# EAGLE design Adafruit nRF52 Bluefruit Feather rev G (EAGLE 6.6.0)
COMPANY: ADAFRUIT INDUSTRIES; DRAWN: KTOWN; REV: G
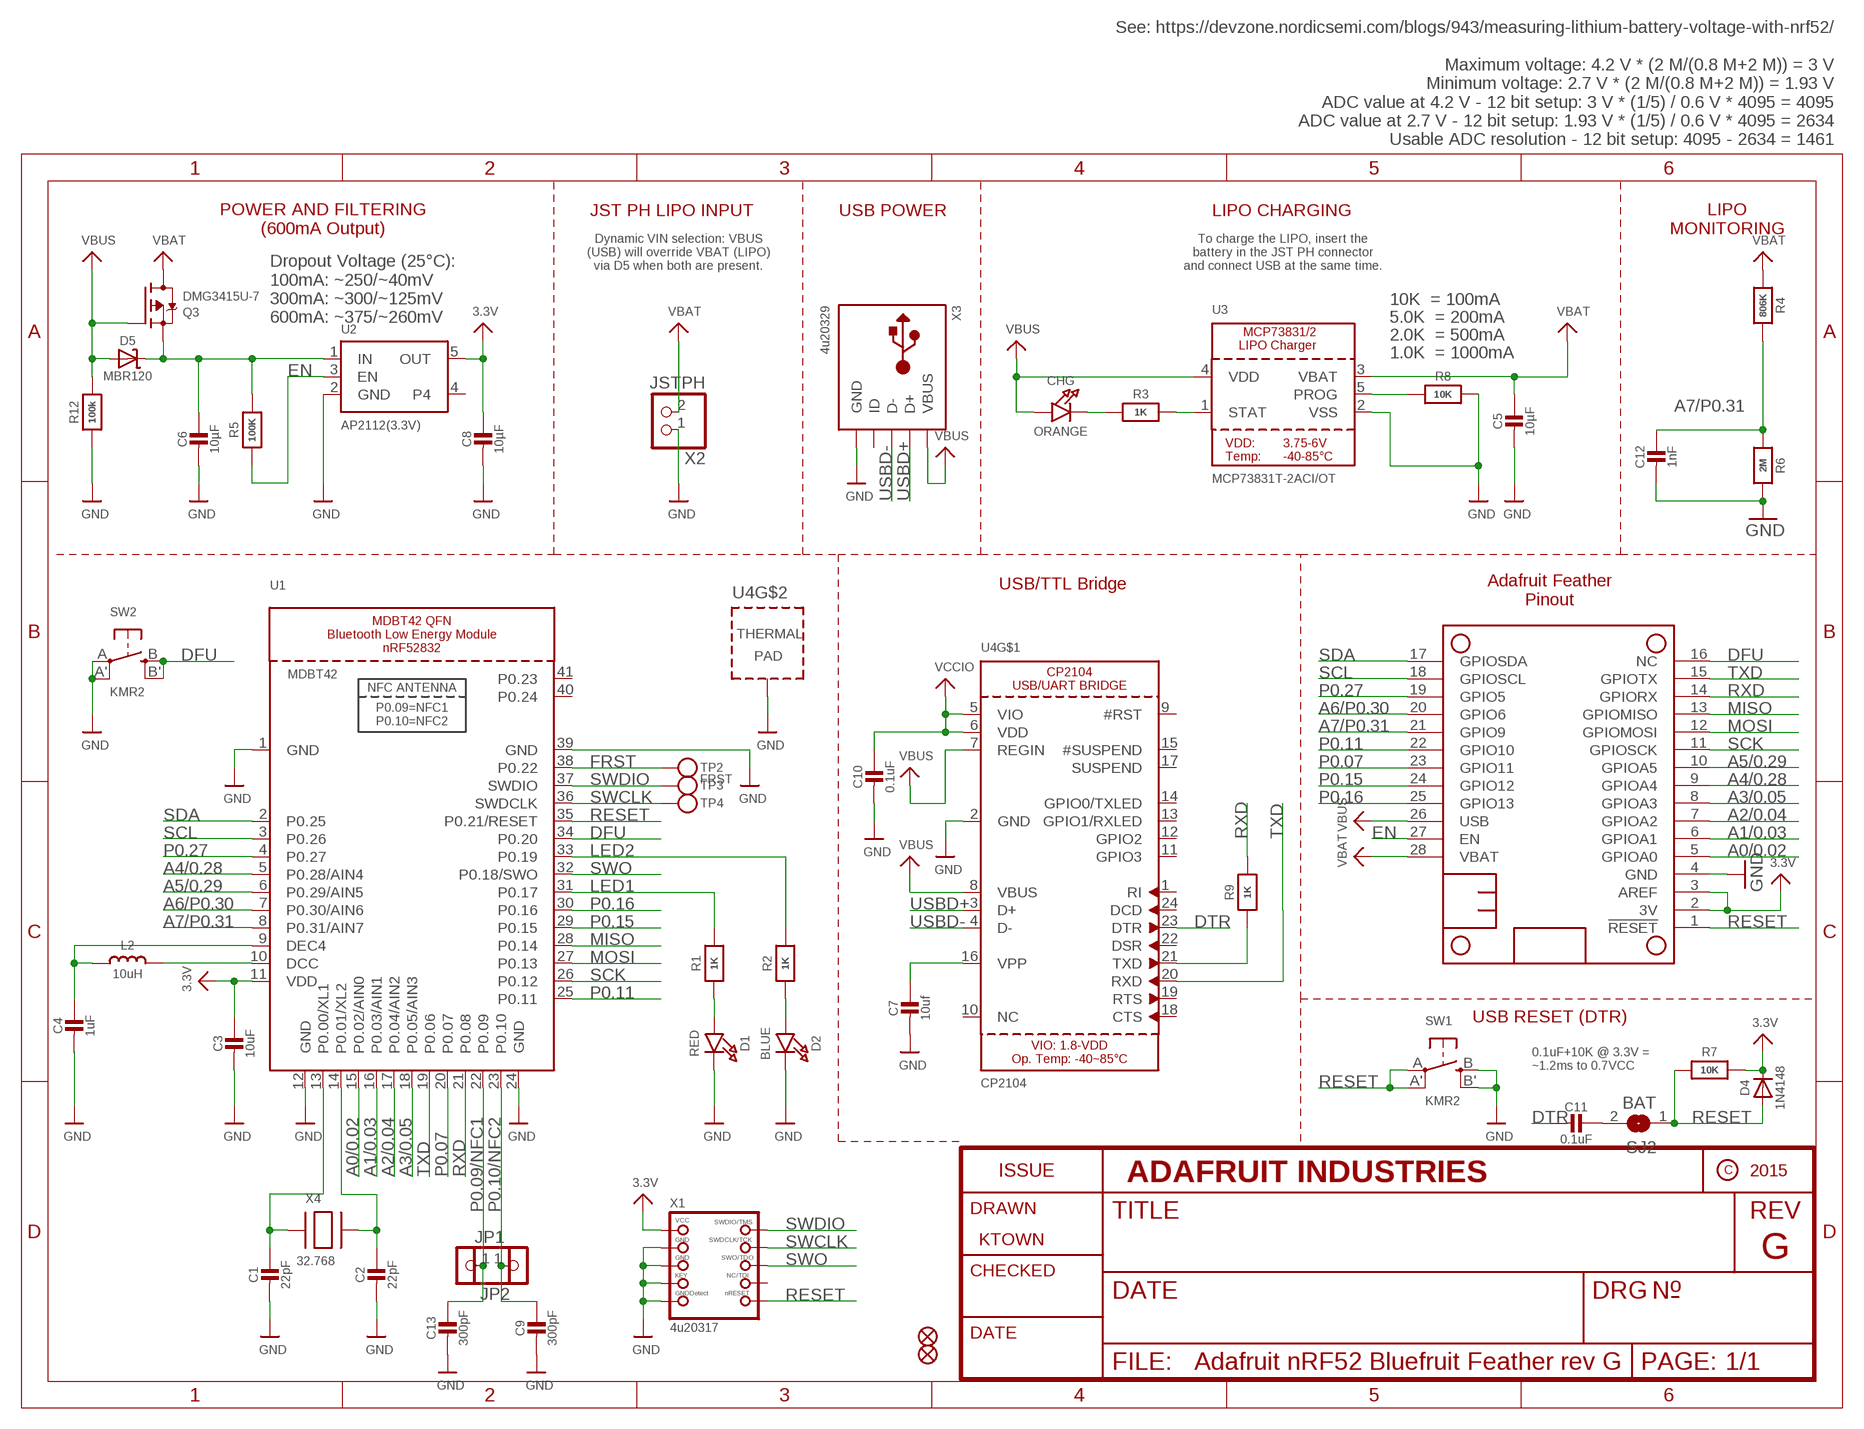
[diagram p0: schematic, sheet 1]

## Parts
C1  22pF  CAP_CERAMIC0603_NO  [0603-NO]
C2  22pF  CAP_CERAMIC0603_NO  [0603-NO]
C3  10uF  CAP_CERAMIC0805-NOOUTLINE  [0805-NO]
C4  1uF  CAP_CERAMIC0603_NO  [0603-NO]
C5  10µF  CAP_CERAMIC0805-NOOUTLINE  [0805-NO]
C6  10µF  CAP_CERAMIC0805-NOOUTLINE  [0805-NO]
C7  10uf  CAP_CERAMIC0805-NOOUTLINE  [0805-NO]
C8  10µF  CAP_CERAMIC0805-NOOUTLINE  [0805-NO]
C9  300pF  CAP_CERAMIC_0603MP  [_0603MP]
C10  0.1uF  CAP_CERAMIC0603_NO  [0603-NO]
C11  0.1uF  CAP_CERAMIC0603_NO  [0603-NO]
C12  1nF  CAP_CERAMIC0603_NO  [0603-NO]
C13  300pF  CAP_CERAMIC_0603MP  [_0603MP]
CHG  ORANGE  LED0805_NOOUTLINE  [CHIPLED_0805_NOOUTLINE]
D1  RED  LED0805_NOOUTLINE  [CHIPLED_0805_NOOUTLINE]
D2  BLUE  LED0805_NOOUTLINE  [CHIPLED_0805_NOOUTLINE]
D4  1N4148  DIODESOD-323  [SOD-323]
D5  MBR120  DIODE-SCHOTTKYSOD-123  [SOD-123]
FID1  FIDUCIAL_1MM  [FIDUCIAL_1MM]
FID3  FIDUCIAL_1MM  [FIDUCIAL_1MM]
JP1  HEADER-1X12MM  [1X01_2MM]
JP2  HEADER-1X12MM  [1X01_2MM]
L2  10uH  INDUCTOR0805-NO  [0805-NO]
MS1  FEATHERWING_NODIM  [FEATHERWING_NODIM]
Q3  DMG3415U-7  MOSFET-P  [SOT23-R]
R1  1K  RESISTOR_0603_NOOUT  [0603-NO]
R2  1K  RESISTOR_0603_NOOUT  [0603-NO]
R3  1K  RESISTOR_0603_NOOUT  [0603-NO]
R4  806K  RESISTOR_0603_NOOUT  [0603-NO]
R5  100K  RESISTOR_0603_NOOUT  [0603-NO]
R6  2M  RESISTOR_0603_NOOUT  [0603-NO]
R7  10K  RESISTOR_0603_NOOUT  [0603-NO]
R8  10K  RESISTOR_0603_NOOUT  [0603-NO]
R9  1K  RESISTOR_0603_NOOUT  [0603-NO]
R12  100k  RESISTOR_0603_NOOUT  [0603-NO]
SJ2  BAT  SOLDERJUMPERCLOSED  [SOLDERJUMPER_CLOSEDWIRE]
SW1  KMR2  SWITCH_TACT_SMT4.6X2.8  [BTN_KMR2_4.6X2.8]
SW2  KMR2  SWITCH_TACT_SMT4.6X2.8  [BTN_KMR2_4.6X2.8]
TP2  FRST  TESTPOINT1.5X2.0MM_NOCREAM  [PAD-1.5X2.0]
TP3  TESTPOINTROUND2MM  [TESTPOINT_ROUND_2MM]
TP4  TESTPOINTROUND2MM  [TESTPOINT_ROUND_2MM]
U1  MDBT42  NRF52832_MODULE_MDBT42  [BLE_MODULE_RAYTAC_MDBT42]
U2  AP2112(3.3V)  VREG_SOT23-5  [SOT23-5]
U3  MCP73831T-2ACI/OT  MCP73831/2  [SOT23-5]
U4  CP2104  [QFN24_4MM_SMSC]
X1  4u20317  JTAG-CORTEXBOXPOSTS  [2X05_1.27MM_BOX_POSTS]
X2  JSTPH  CON_JST_PH_2PIN  [JSTPH2]
X3  4u20329  USB_MICRO_20329_V2  [4UCONN_20329_V2]
X4  32.768  XTAL-3.2X1.5  [XTAL3215]

## Nets
3.3V: C3.1 C8.1 D4.C MS1.2(3V) MS1.3(AREF) R7.2 U1.11(VDD) U2.5(OUT) X1.1(VCC)
A0/0.02: MS1.5(GPIOA0) U1.15(P0.02/AIN0)
A1/0.03: MS1.6(GPIOA1) U1.16(P0.03/AIN1)
A2/0.04: MS1.7(GPIOA2) U1.17(P0.04/AIN2)
A3/0.05: MS1.8(GPIOA3) U1.18(P0.05/AIN3)
A4/0.28: MS1.9(GPIOA4) U1.5(P0.28/AIN4)
A5/0.29: MS1.10(GPIOA5) U1.6(P0.29/AIN5)
A6/P0.30: MS1.20(GPIO6) U1.7(P0.30/AIN6)
A7/P0.31: C12.1 MS1.21(GPIO9) R4.2 R6.1 U1.8(P0.31/AIN7)
DFU: MS1.16(NC) SW2.B'(S1) SW2.B(S) U1.34(P0.20)
DTR: C11.2 U4.23(DTR)
EN: MS1.27(EN) R5.1 U2.3(EN)
FRST: TP2.P$1 U1.38(P0.22)
GND: C1.2 C2.2 C3.2 C4.2 C5.2 C6.2 C7.2 C8.2 C9.2 C10.2 C12.2 C13.2 D1.C D2.C MS1.4(GND) R6.2 R8.2 R12.1 SW1.B'(S1) SW1.B(S) SW2.A'(P1) SW2.A(P) U1.1(GND) U1.12(GND) U1.24(GND) U1.39(GND) U2.2(GND) U3.2(VSS) U4.2(GND) U4.THERM(TP) X1.3(GND) X1.5(GND) X1.7(KEY) X1.9(GNDDETECT) X2.1 X3.BASE@1(GND) X3.BASE@2(GND) X3.GND X3.SPRT@1(GND) X3.SPRT@2(GND) X3.SPRT@3(GND) X3.SPRT@4(GND)
LED1: R1.2 U1.31(P0.17)
LED2: R2.2 U1.33(P0.19)
MISO: MS1.13(GPIOMISO) U1.28(P0.14)
MOSI: MS1.12(GPIOMOSI) U1.27(P0.13)
N$1: C1.1 U1.13(P0.00/XL1) X4.P$1
N$2: C2.1 U1.14(P0.01/XL2) X4.P$2
N$3: L2.2 U1.10(DCC)
N$4: CHG.C R3.1
N$5: D1.A R1.1
N$7: D2.A R2.1
N$8: C4.1 L2.1 U1.9(DEC4)
N$9: R3.2 U3.1(STAT)
N$10: R8.1 U3.5(PROG)
N$11: R9.1 U4.21(TXD)
N$13: C11.1 SJ2.2
N$14: C7.1 U4.16(VPP)
P0.07: MS1.23(GPIO11) U1.20(P0.07)
P0.09/NFC1: C13.1 JP2.1 U1.22(P0.09)
P0.10/NFC2: C9.1 JP1.1 U1.23(P0.10)
P0.11: MS1.22(GPIO10) U1.25(P0.11)
P0.15: MS1.24(GPIO12) U1.29(P0.15)
P0.16: MS1.25(GPIO13) U1.30(P0.16)
P0.27: MS1.19(GPIO5) U1.4(P0.27)
RESET: D4.A MS1.1(!RESET) R7.1 SJ2.1 SW1.A'(P1) SW1.A(P) U1.35(P0.21/RESET) X1.10(NRESET)
RXD: MS1.14(GPIORX) R9.2 U1.21(P0.08)
SCK: MS1.11(GPIOSCK) U1.26(P0.12)
SCL: MS1.18(GPIOSCL) U1.3(P0.26)
SDA: MS1.17(GPIOSDA) U1.2(P0.25)
SWCLK: TP4.P$1 U1.36(SWDCLK) X1.4(SWDCLK)
SWDIO: TP3.P$1 U1.37(SWDIO) X1.2(SWDIO)
SWO: U1.32(P0.18/SWO) X1.6(SWO)
TXD: MS1.15(GPIOTX) U1.19(P0.06) U4.20(RXD)
USBD+: U4.3(D+) X3.D+
USBD-: U4.4(D-) X3.D-
VBAT: C5.1 MS1.28(VBAT) Q3.3(D) R4.1 U3.3(VBAT) X2.2
VBUS: CHG.A D5.A MS1.26(USB) Q3.1(G) R12.2 U3.4(VDD) U4.7(REGIN) U4.8(VBUS) X3.VBUS
VCCIO: C10.1 U4.5(VIO) U4.6(VDD)
VIN: C6.1 D5.C Q3.2(S) R5.2 U2.1(IN)
Unconnected: U1.40(P0.24) U1.41(P0.23) U2.4 U4.1(RI) U4.9(#RST) U4.10(NC) U4.11(GPIO3) U4.12(GPIO2) U4.13(GPIO1/RXLED) U4.14(GPIO0/TXLED) U4.15(#SUSPEND) U4.17(SUSPEND) U4.18(CTS) U4.19(RTS) U4.22(DSR) U4.24(DCD) X1.8(TDI) X3.ID

## Notes on the sheet
- See: https://devzone.nordicsemi.com/blogs/943/measuring-lithium-battery-voltage-with-nrf52/
  
  Maximum voltage: 4.2 V * (2 M/(0.8 M+2 M)) = 3 V
  Minimum voltage: 2.7 V * (2 M/(0.8 M+2 M)) = 1.93 V
  ADC value at 4.2 V - 12 bit setup: 3 V * (1/5) / 0.6 V * 4095 = 4095
  ADC value at 2.7 V - 12 bit setup: 1.93 V * (1/5) / 0.6 V * 4095 = 2634
  Usable ADC resolution - 12 bit setup: 4095 - 2634 = 1461
- JST PH LIPO INPUT | USB POWER | LIPO CHARGING
- POWER AND FILTERING
  (600mA Output)
- LIPO
  MONITORING
- Dynamic VIN selection: VBUS
  (USB) will override VBAT (LIPO)
  via D5 when both are present.
- To charge the LIPO, insert the
  battery in the JST PH connector
  and connect USB at the same time.
- 10K  = 100mA
- Dropout Voltage (25°C):
  100mA: ~250/~40mV
  300mA: ~300/~125mV
  600mA: ~375/~260mV
- 5.0K  = 200mA
- 2.0K  = 500mA
- 1.0K  = 1000mA
- USB/TTL Bridge
- Adafruit Feather
  Pinout
- USB RESET (DTR)
- 0.1uF+10K @ 3.3V =
  ~1.2ms to 0.7VCC

## Library data of the parts
C1-C13 = microbuilder:CAP_CERAMIC: Ceramic Capacitors For new designs, use the packages preceded by an '_' character since they are more reliable: The following footprints should be used on most boards: _0402 - Standard footprint for regular board layouts _0603 - Standard footprint for regular board layouts _0805 - Standard footprint for regular board layouts _1206 - Standard footprint for regular board layouts For extremely tight-pitch boards where space is at a premium, the following 'micro-pitch' footprints can be used (smaller pads, no silkscreen outline, etc.): _0402MP - Micro-pitch footprint for very dense/compact boards _0603MP - Micro-pitch footprint for very dense/compact boards _0805MP - Micro-pitch footprint for very dense/compact boards _1206MP - Micro-pitch footprint for very dense/compact boards
CHG D1 D2 = microbuilder:LED: LED 0603 - 0603 Surface Mount Package 2mA: Green LED - Low Power (3.9mcd, 2ma, 1.7Vf) - Digikey: 475-2709-2-ND Orange LED - Low Power (9.8mcd, 2ma, 1.8Vf) - Digikey: 475-1194-2-ND Red LED - Low Power (5mcd, 2ma, 1.8Vf) - Digikey: 475-1195-2-ND Yellow LED - Low Power (7mcd, 2ma, 1.8Vf) - Digikey: 475-1196-2-ND 5mA: Blue LED - Low Power (17mcd, 5ma, 2.9Vf) - Digikey: LNJ937W8CRACT-ND 0805 - 0805 Surface Mount Package 2mA: Red LED (8.8mcd, 2mA, 1.8Vf, Clear) - Low Power [Digikey: 475-2510-1-ND] Green LED (5mcd, 2mA, 1.8Vf, Clear) - Low Power [Digikey: 475-2730-1-ND] Yellow LED (11.3mcd, 2mA, 1.8Vf, Clear) - Low Power [Digikey: 475-2555-1-ND] 20mA: Red LED (104mcd, 20mA, Diffused) - LS R976 [Digikey: 475-1278-6-ND] Red LED (12mcd, 20mA, 2.0Vf, Clear) - APT2012EC [Digikey: 754-1128-1-ND] Green LED (15mcd, 20mA, 2.2Vf, Clear) - APT2012GC [Digikey: 754-1131-1-ND] Orange LED (160mcd, 20mA, 2.1Vf, Clear) - APT2012SECK [Digikey: 754-1130-1-ND] 1206 - 1206 Surface Mount Package Green LED (26mcd, 20mA, Diffused) - LG N971 [Digikey: 475-1407-6-ND] Red LED (15mcd, 20mA, Diffused) - LH N974 [Digikey: 475-1416-6-ND] Cree - Cree High-Power Surface Mount LEDs XPEBWT-L1-0000-00D50 - White 111lm 350mA 2.9Vf 6200K 110° XTEAWT-00-0000-00000LEE3 - White 114lm 350mA 2.85Vf 5000K 115° Everlight - Everlight 45-21 Series Surface Mount LEDs 45-21/QK2C-B2832AC2CB2/2T - Warm White 2000mcd 20mA 3.25Vf 3050K 120° 45-21/LK2C-B38452C4CB2/2T - Nuetral White 2000mcd 20mA 3.25Vf 4150K 120° 45-21/LK2C-B50634C6CB2/2T - Cold White 2200mcd 20mA 3.25Vf 5650K 120° PLCC2 Reverse Mount LS T77K-J1L2-1-0-2-R18-Z - Red 11.25mcd 2mA 1.8Vf 630nm 120° LO T77K-L1M2-24-Z - Orange 19.6mcd 2mA 1.8Vf 606nm 120° LY T77K-K2M1-26-Z - Yellow 15.7mcd 2mA 1.8Vf 587nm 120°
D4 = microbuilder:DIODE: Diode SMA Model Volts Amps Type Vf Ir Digikey # Notes SSA34-E3 40V 3A Schottky 480mV @ 3A 200uA @ 40V SSA34-E3/61TGITR-ND CDBA120-G 20V 1A Schottky 500mV @ 1A 500uA @ 20V 641-1014-6-ND REEL MBRA210 10V 2A Schottky 350mV @ 2A 700uA @ 10V MBRA210LT3 SOD-123 Model Volts Amps Type Vf Ir Order # Notes BAT54T1G 30V 200mA Schottky 800mV @ 200mA 2uA @ 25V BAT54T1GOSTR-ND B0530W 30V 500mA Schottky 430mV @ 500mA 130uA @ 30V B0530W-FDICT-ND REEL MBR120 20V 1A Schottky 340mV @ 1A MBR120VLSFT1GOSCT-ND SOD-323 Model Volts Amps Type Vf Ir Order # Notes PMEG2005EJ 20V 500mA Schottky 355mV @ 500mA 568-4110-1-ND ZLLS410 10V 570mA Schottky 380mV @ 570mA ZLLS410CT-ND 1N4148WS 75V 150mA Silicon/Simple 1V 1N4148WSFSCT-ND REEL SOD-523 Model Volts Amps Type Vf Ir Order # Notes BAT54XV2 30V 200mA Schottky 0.8V @ 100mA BAT54XV2CT-ND TB751S 30V 30mA Schottky RB751S-40TE61CT-ND SOT23-R/W (R = Solder Paste/Reflow Ovens, W = Hand-Soldering) Model Volts Amps Type Vf Ir Order # Notes BAT54FILM 40V 300mA Schottky 497-7162-1-ND POWERDI-5 Model Volts Amps Type Vf Ir Order # Notes PDS560 60V 5A Schottky 670mV @ 5A 150uA @ 60V PDS560DICT-ND
D5 = microbuilder:DIODE-SCHOTTKY
FID1 FID3 = microbuilder:FIDUCIAL: Fiducial Alignment Points Various fiducial points for machine vision alignment.; BOM: EXCLUDE
JP1 JP2 = microbuilder:HEADER-1X1: PIN HEADER
L2 = microbuilder:INDUCTOR: Inductors 0603: 10nH Ceramic Inductor - microwire antenna/RF (Digikey: 712-1434-2-ND) 0805: 560nH Ceramic Inductor - RF (Digikey: 553-1047-1-ND) 270nH Ceramic Inductor - Q = 40@250MHz, +-5%, 1 Ohm DC Resistance (Digikey: 535-10506-2-ND) 1007 (2518 Metric) SMT: 10µH 10% 250mOhm 820mA 1007 Inductor (Digikey: 587-2189-1-ND) 22µH 10% 500mOhm 580mA 1007 Inductor (Digikey: 587-2190-1-ND) 47µH 10% 950mOhm 420mA 1007 Inductor (Digikey: 587-2191-1-ND) 47µH 5% 100mOhm 1A 1008 Inductor (Digikey: 732-1816-1-ND) 5.0x5.0mm (Taiyo Yuden NR5040 Series) 6.8µH 20% 2.3A 64mOhm Inductor (Digikey: 587-2374-2-ND) 5.0x5.0mm (TDK VLC5045 Series) 4.7µH 20% 3.3A 34mOhm Inductor (Digikey: 445-6526-1-ND) 6.8µH 20% 2.7A 46mOhm Inductor (Digikey: 445-6527-1-ND) 6.0x6.0mm (TDK VLC6045 Series) 4.7µH 20% 3.8A 27mOhm Inductor (Digikey: 445-6538-2-ND) 6.8µH 20% 3A 41mOhm Inductor (Digikey: 445-6540-1-ND) 6.2µH 30% 2.2A 45mOhm Inductor (Digikey: SRR5028-6R2YCT-ND) - Not TDK VLC6045 but footprint should match 6.0x6.0mm (TDK SLF6045 Series) 6.8uH 30% 2A 33mOhm Inductor (Digikey: 445-4572-1-ND, Mouser: 810-SLF645T6R8N2R0PF) 6.0x6.0mm (Sumida CDRH5D28 Series) 6.2uH 30% 1.8A 45mOhm Inductor (Digikey: 308-1542-1-ND) Taiyo Yuden NR3015T2R2M - 2.2uH 20% 1.5A (Digikey: 587-1648-2-ND, Mouser: 963-NR3015T2R2M) - Used with TI TPS62172 CoilCraft RFID Transponder Coil - MA5532-AE (For use with AS3935 Lightning Sensor) Taiyo Yuden NRH2412T2R2MNGH - 2.2uH 20% 1AA (Digikey: 587-3443-1-ND) - Used with TI LM3671 Vishay IHLP 1.0uH Molded Inductor - 24mOhm DCR, 5A, +/-20%, -55°C-125°C (Digikey: 541-1319-1-ND)
MS1 = microbuilder:FEATHERWING
Q3 = microbuilder:MOSFET-P: P-Channel Mosfet LEGEND VDS: Voltage Drain-Source ID: Drain Current RDS(ON): Drain-Source On-State Resistance VGS(TH): Gate-Source Threshold Voltage CISS: Drain-Source Input Capacitance SOT-23 Name VDS ID RDS(ON) VGS(TH) CISS Order Number IRLML5103 30V 760mA 600 mOhm -- 75pF @ 25V Digikey: IRLML5103PBFCT-ND IRLML6401 12V 4.3A 50 mOhm 950mV @ 250µA 830pF @ 10V Digikey: IRLML6401PBFTR-ND NTR0202PL 20V 400mA 800 mOhm 2.3V @ 250uA 70pF @ 5V Digikey: NTR0202PLT1GOSTR-ND NTR4101PT1G 20V 1.8A 85 mOhm 1.2V @ 250uA 675pF @ 10V Digikey: NTR4101PT1GOSCT-ND DMP2004K 20V 600mA 900 mOhm 1V @ 250uA 175pF @ 16V Digikey: DMP2004KDICT-ND PMV65XP 20V 3.9A 76 mOhm 950mV @ 1mA 725pF @ 20V Digikey: 568-2358-2-ND TO-252 Name VDS ID RDS(ON) VGS(TH) CISS Order Number AOD417 30V 25A 34 mOhm 3V @ 250µA 920pF @ 15V Digikey: 785-1106-2-ND
R1-R9 R12 = microbuilder:RESISTOR: Resistors For new designs, use the packages preceded by an '_' character since they are more reliable: The following footprints should be used on most boards: _0402 - Standard footprint for regular board layouts _0603 - Standard footprint for regular board layouts _0805 - Standard footprint for regular board layouts _1206 - Standard footprint for regular board layouts For extremely tight-pitch boards where space is at a premium, the following 'micro-pitch' footprints can be used (smaller pads, no silkscreen outline, etc.): _0402MP - Micro-pitch footprint for very dense/compact boards _0603MP - Micro-pitch footprint for very dense/compact boards _0805MP - Micro-pitch footprint for very dense/compact boards _1206MP - Micro-pitch footprint for very dense/compact boards
SJ2 = microbuilder:SOLDERJUMPER: SMD Solder JUMPER Solder the two pads together to create a connection, or remove the solder to break it. REFLOW - Use this footprint for solder paste and reflow ovens. WAVE - Use this footprint for hand-soldering (larger pads). CLOSED - Has a trace between the two pads to ensure it is closed by default. The trace needs to be cut to disable the jumper, and can be closed again by creating a solder bridge between the two pads.
SW1 SW2 = microbuilder:SWITCH_TACT_SMT: SMT Tact Switches 6x6mm - Digikey: P12940SCT-ND KMR2 (4.6x2.8mm) - Digikey: 401-1426-1-ND EVQ-PQHB55 - Light Touch, 160GF (4.5x4.5mm) - Digikey: P8090SCT-ND KMT0 - KMT021 NGJ LHS (etc.) IP68/Waterproof - Digikey: CKN10289CT-ND
TP2-TP4 = microbuilder:TESTPOINT: Test Point Various test points for characterisation and PCB testing TESTPOINT_SMT - Compact Surface Mount Test Point [Digikey: 5016KTR-ND]
U1 = microbuilder:NRF52832_MODULE_MDBT42: MDBT42 - BLE Module (nRF52832 QFN) VDD: 1.7-3.6V
U2 = microbuilder:VREG_SOT23-5: SOT23-5 Fixed Voltage Regulators Part Current Out V Out V In V Dropout θJA (°C/W) TJ (°C) Digikey Part No. ADP121 150mA 3.3V 3.4-5.5V 0.09V @ 150mA -- -- ADP121-AUJZ33R7CT-ND ADP121 150mA 3.0V 3.1-5.5V 0.09V @ 150mA -- -- ADP121-AUJZ30R7CT-ND ADP122 300mA 3.3V 3.4-5.5V 0.085V @ 300mA -- -- ADP122AUJZ-3.3-R7CT-ND ADP1712 300mA 3.3V 3.5-5.5V 0.17V @ 300mA -- -- ADP1712AUJZ-3.3-R7TR-ND AP7311 (Low Cost) 150mA 3.3V 3.5-6V 0.15V @ 150mA -- -- AP7311-33WG-7DICT-ND LD39015M18R 150mA 1.8V 1.9V-5.5V 0.08V @ 100mA -- -- 497-6977-1-ND LP2985A-33DBVR 150mA 3.3V 3.3-16V 0.28V @ 150mA 206 150 296-18479-1-ND MCP1824T-3302E/OT 300mA 3.3V 3.5V-6V 0.2V @ 300mA -- -- MCP1824T-3302E/OTCT-ND MIC5205-2.5YM5 TR 150mA 2.5V 2.7-16V 0.165V @ 150mA -- -- 576-1257-2-ND MIC5205-3.0YM5 TR 150mA 3.0V 3.2V-16V 0.165V @ 150mA -- -- 576-1258-2-ND MIC5205-3.3YM5 TR 150mA 3.3V 3.5V-16V 0.165V @ 150mA -- -- 576-1259-2-ND TPS780330220 150mA 3.3V+2.2V 3.6-5.5V 250mV Max -- -- 296-23332-1-ND TDA3663/N1,135 100mA 3.3V 3.5-45V 0.18V @ 50mA -- -- 568-5343-1-ND Max operating temp can be calculated using θJA, TJ (max junction temperature), and power in watts. Set the "Maximum Ambient Temperature" until it reaches TJ ("Max Junction Temperature"), which is the absolute limit for safe use of the regulator: Heat Sink Temperature Calculator <http://www.daycounter.com/Calculators/Heat-Sink-Temperature-Calculator.phtml> For example, With 12V source into a 3.3V LP2985 and a 30mA load, we are dissipating (12V-3.3V) * 0.03A = 0.261W. With a θJA of 206 °C/W, a TJ of 150°C, and 261mW we can safely use the chip without a heat sink up to 75°C (=147.1°C Junction Temperature).
U3 = microbuilder:MCP73831/2: MCP73831/2 LIPO Charger VDD: 3.75 - 6V Temp -40 - 85°C Programmable Charge Rate: 15-500mA NOTE: STAT is a tri-state logic output on the MCP73831 and an open-drain output on the MCP73832. SOT23-5 with 4.2V output and tri-state logic on STAT = MCP73831T-2ACI/OT
U4 = microbuilder:CP2104: CP2104 - USB to UART Bridge VDD Output: 3.45V
X1 = microbuilder:JTAG-CORTEX: Serial Wire (SW-DP) Connector Standard 0.05" 10-pin connector is for use with the Cortex M and Cortex A SWD (serial wire debugger) interface (SW-DP) Connectors 2x05_1.27MM_SMT - Inexpensive surface-mount header with bare pins, compatible with standard 10-pin SWD cables (4UCON: 16846) 2x05_1.27MM_BOX_NOPOSTS - Polarised surface-mount box (4UCON with caps: 19735, without caps: 15117 2x05_1.27MM_BOX_POSTS - Polarised surface-mount box with mounting holes (4UCON: 20317) Pinout: http://infocenter.arm.com/help/topic/com.arm.doc.faqs/attached/13634/cortex_debug_connectors.pdf http://www.keil.com/peripherals/coresight/connectors.asp
X2 = microbuilder:CON_JST_PH_2PIN: JST 2-Pin Right-Angle Connector PH-Series - 4UConnector: 17311 SH-Series - 4UConnector: 07278
X3 = microbuilder:USB: USB Connectors USBMINIB - Surface Mount Female Mini-B USB Connector 4UConnector: 06564
X4 = adafruit2:XTAL: Low cost SMT crystals, no capacitors included http://www.ladyada.net/library/eagle

## Net classes
3 usbvcc: width 0.305 mm, drill 0.483 mm, clearance 0.203 mm

## Board
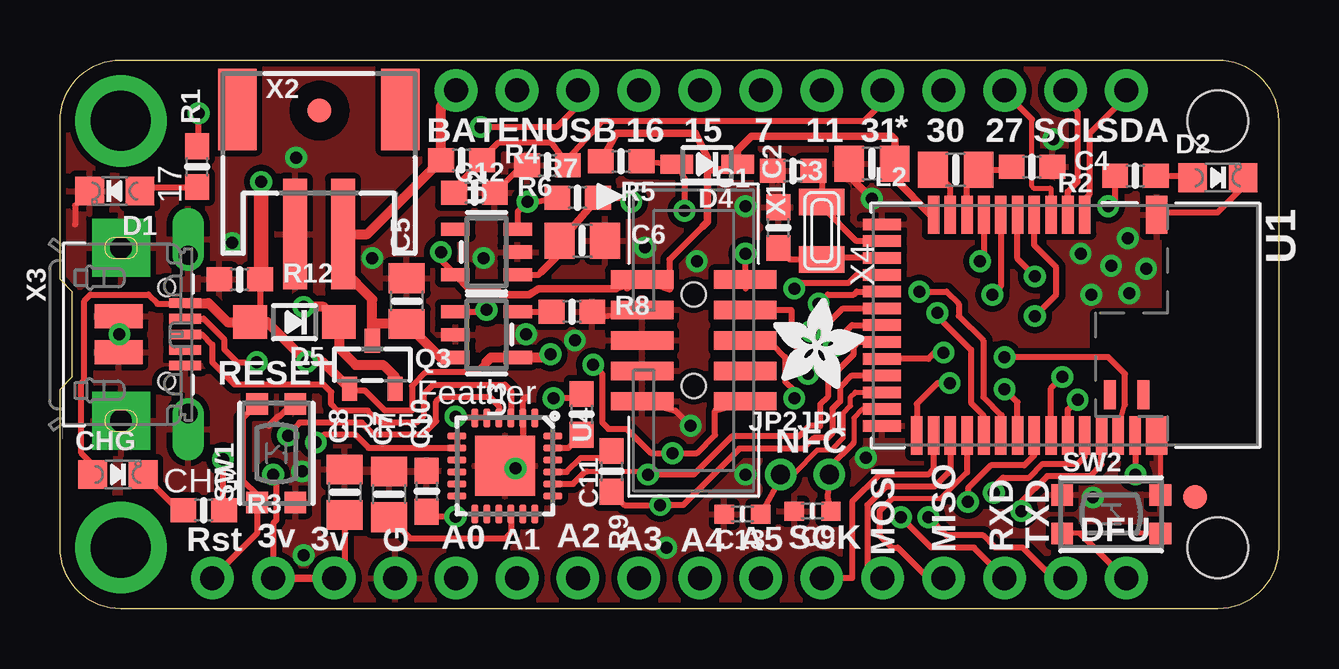
[diagram p1: board, top side]
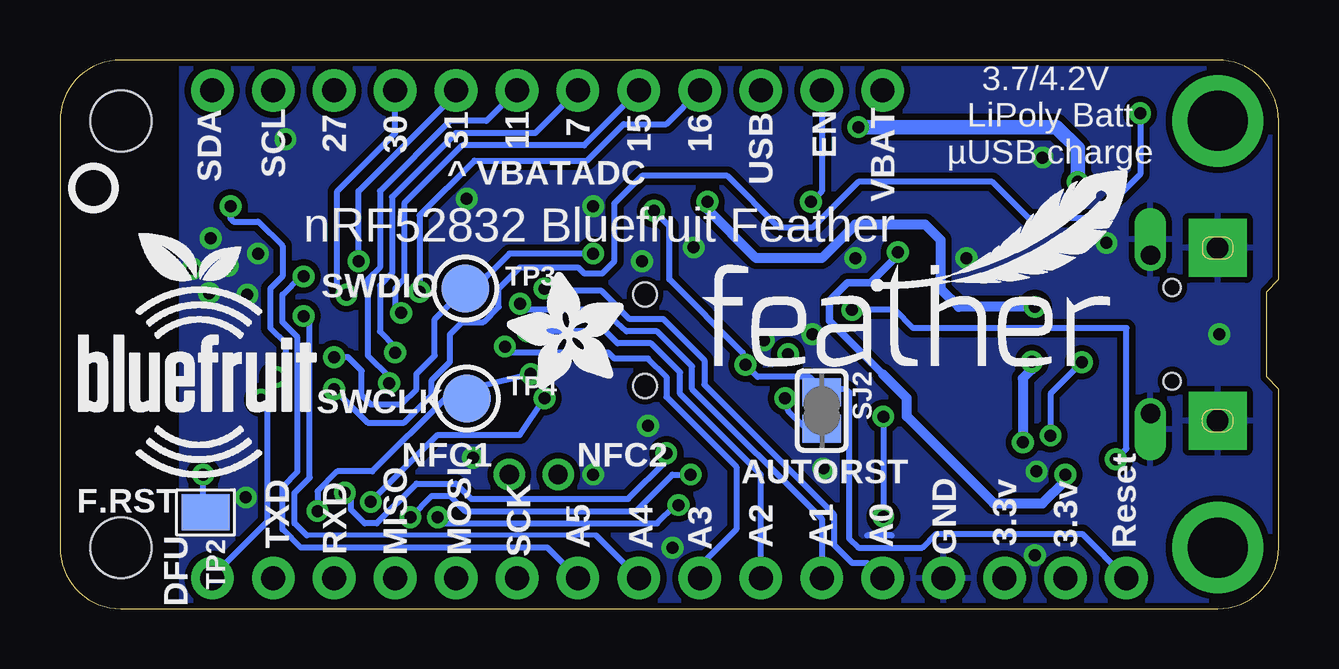
[diagram p2: board, bottom side, seen from below]

Size 50.8 x 22.86 mm. Coordinates in mm from the lower left corner, seen from the top.
Outline: 50.8,20.32 50.8,2.54 arc-90 48.26,0 2.54,0 arc-90 0,2.54 0,9.14 0.51,9.65 0.51,13.21 0,13.72 0,20.32 arc-90 2.54,22.86 48.26,22.86 arc-90 50.8,20.32
Copper layers (1*16): Top 0.035mm / dielectric 1.5mm / Bottom 0.035mm
Design rules "adafruit *": minimum track width 8mil, minimum drill 15.5mil, track to track 8mil, track to pad 8mil, pad to pad 8mil, via to via 8mil, smd to smd 8mil, copper to edge 10mil, drill to drill 8mil, minimum pad ring 10mil, minimum via ring 8mil, stop-mask expansion 2mil, vias tented up to drill 20mil, thermal gap 10mil

### Footprints (pad centres in the part's own frame; a part is rotated, then mirrored left to right if it is on the bottom)
0603-NO = smd 1.075 x 1: 1 -0.85,0; 2 0.85,0
0805-NO = smd 1.24 x 1.5: 1 -0.95,0; 2 0.95,0
_0603MP = smd 0.8 x 0.8: 1 -0.762,0; 2 0.762,0
CHIPLED_0805_NOOUTLINE = smd 1.2 x 1.2: A 0,-1.05; C 0,1.05
SOD-323 = smd 1.35 x 0.8: A 1.27,0; C -1.27,0
SOD-123 = smd 1.4 x 1.4: A 1.85,0; C -1.85,0
FIDUCIAL_1MM = smd 1 x 1: 1 0,0
1X01_2MM = drill 0.8 pad 1.27: 1 0,0
FEATHERWING_NODIM = drill 1 pad 1.778: 1 6.35,1.27; 2 8.89,1.27; 3 11.43,1.27; 4 13.97,1.27; 5 16.51,1.27; 6 19.05,1.27; 7 21.59,1.27; 8 24.13,1.27; 9 26.67,1.27; 10 29.21,1.27; 11 31.75,1.27; 12 34.29,1.27; 13 36.83,1.27; 14 39.37,1.27; 15 41.91,1.27; 16 44.45,1.27; 17 44.45,21.59; 18 41.91,21.59; 19 39.37,21.59; 20 36.83,21.59; 21 34.29,21.59; 22 31.75,21.59; 23 29.21,21.59; 24 26.67,21.59; 25 24.13,21.59; 26 21.59,21.59; 27 19.05,21.59; 28 16.51,21.59 | drill 2.5 pad 3.81: P$1 2.54,20.32; P$2 2.54,2.54 | hole 2.54: 48.26,20.32; 48.26,2.54
SOT23-R = smd 0.635 x 1.016: 1 -0.95,-1; 2 0.95,-1; 3 0,1
SOLDERJUMPER_CLOSEDWIRE = smd 1.168 x 1.6: 1 -0.762,0; 2 0.762,0 | smd 0.635 x 0.203: WIRE 0,0
BTN_KMR2_4.6X2.8 = smd 0.9 x 0.9: A 2.05,0.8; A' -2.05,0.8; B 2.05,-0.8; B' -2.05,-0.8
PAD-1.5X2.0 = smd 1.5 x 2: P$1 0,0
TESTPOINT_ROUND_2MM = smd 2 x 2: P$1 0,0
BLE_MODULE_RAYTAC_MDBT42 = smd 1.6 x 0.9: 1 -4.6,3.8; 39 4.6,3.8 | smd 1.6 x 0.48: 2 -4.6,0.8; 3 -4.6,0.1; 4 -4.6,-0.6; 5 -4.6,-1.3; 6 -4.6,-2; 7 -4.6,-2.7; 8 -4.6,-3.4; 9 -4.6,-4.1; 10 -4.6,-4.8; 11 -4.6,-5.5; 25 4.6,-6.2; 26 4.6,-5.5; 27 4.6,-4.8; 28 4.6,-4.1; 29 4.6,-3.4; 30 4.6,-2.7; 31 4.6,-2; 32 4.6,-1.3; 33 4.6,-0.6; 34 4.6,0.1; 35 4.6,0.8; 36 4.6,1.5; 37 4.6,2.2; 38 4.6,2.9 | smd 0.48 x 1.6: 12 -4.2,-7.65; 13 -3.5,-7.65; 14 -2.8,-7.65; 15 -2.1,-7.65; 16 -1.4,-7.65; 17 -0.7,-7.65; 18 0,-7.65; 19 0.7,-7.65; 20 1.4,-7.65; 21 2.1,-7.65; 22 2.8,-7.65; 23 3.5,-7.65; 24 4.2,-7.65 | smd 1.2 x 0.5: 40 2.9,3.25; 41 2.9,1.85
SOT23-5 = smd 0.55 x 1.2: 1 -0.95,-1.3; 2 0,-1.3; 3 0.95,-1.3; 4 0.95,1.3; 5 -0.95,1.3
QFN24_4MM_SMSC = smd 0.8 x 0.28: 1 -2,1.25; 2 -2,0.75; 3 -2,0.25; 4 -2,-0.25; 5 -2,-0.75; 6 -2,-1.25; 13 2,-1.25; 14 2,-0.75; 15 2,-0.25; 16 2,0.25; 17 2,0.75; 18 2,1.25 | smd 0.28 x 0.8: 7 -1.25,-2; 8 -0.75,-2; 9 -0.25,-2; 10 0.25,-2; 11 0.75,-2; 12 1.25,-2; 19 1.25,2; 20 0.75,2; 21 0.25,2; 22 -0.25,2; 23 -0.75,2; 24 -1.25,2 | smd 2.5 x 2.5: THERM 0,0
2X05_1.27MM_BOX_POSTS = smd 0.76 x 2.6: 1 -2.54,-2.15; 2 -2.54,2.15; 3 -1.27,-2.15; 4 -1.27,2.15; 5 0,-2.15; 6 0,2.15; 7 1.27,-2.15; 8 1.27,2.15; 9 2.54,-2.15; 10 2.54,2.15 | hole 1: -1.905,0; 1.905,0
JSTPH2 = smd 1 x 4.6: 1 -1,-3.7; 2 1,-3.7 | smd 1.6 x 3.4: NC1 -3.4,1.5; NC2 3.4,1.5
4UCONN_20329_V2 = smd 1 x 2: BASE@1 -0.75,-2; BASE@2 0.75,-2 | smd 0.4 x 1.35: D+ 0,0.775; D- -0.65,0.775; GND 1.3,0.775; ID 0.65,0.775; VBUS -1.3,0.775 | drill 0.8 pad 1.143 offset: SPRT@1 -3.3,0.9; SPRT@2 3.3,0.9 | drill 0.9 pad 2.413 square: SPRT@3 -3.6,-1.9; SPRT@4 3.6,-1.9 | hole 0.7: -1.95,0; 1.95,0
XTAL3215 = smd 1.1 x 1.9: P$1 1.2,0; P$2 -1.2,0

### Placement (x,y rotation side)
C1  30.56,18.24 180 top
C2  29.95,15.88 90 top
C3  33.85,18.54 180 top
C4  40.51,18.4 0 top
C5  14.45,12.81 90 top
C6  21.77,15.33 0 top
C7  13.72,4.76 90 top
C8  11.87,4.85 90 top
C9  31.37,4.06 180 top
C10  15.29,4.89 90 top
C11  21.74,8.09 270 top
C12  20.32,18.48 180 top
C13  28.45,3.94 180 top
CHG  2.41,5.59 270 top
D1  2.29,17.4 90 top
D2  48.26,17.96 270 top
D4  26.97,18.52 180 top
D5  9.78,11.94 180 top
FID1  10.82,20.75 0 top
FID3  47.32,4.65 0 top
JP1  32.07,5.59 0 top
JP2  30.04,5.59 0 top
L2  37.34,18.29 180 top
MS1  0,0 0 top
Q3  13.02,10.16 0 top
R1  5.72,18.42 90 top
R2  44.83,18.03 180 top
R3  5.99,4.1 0 top
R4  16.74,18.68 0 top
R5  21.58,17.12 0 top
R6  17.27,17.32 0 top
R7  23.39,18.64 180 top
R8  21.34,12.37 0 top
R9  22.99,5.72 270 top
R12  7.49,13.72 0 top
SJ2  19.05,8.26 270 bottom
SW1  9.02,6.48 90 top
SW2  43.81,3.94 0 top
TP2  44.73,4.01 270 bottom
TP3  33.91,13.34 0 bottom
TP4  33.85,8.76 0 bottom
U1  41.91,11.81 270 top
U2  17.78,14.86 90 top
U3  17.78,11.42 270 top
U4  18.54,5.94 270 top
U$17  [PCBFEAT-REV-040]  49.4,17.53 0 bottom
U$45  [BLUEFRUITLOGO_100MM]  50.04,5.46 0 bottom
U$46  [FEATHERLOGO_MED]  24.13,10.03 0 bottom
U$47  [ADAFRUIT_5MM]  27.3,9.14 90 bottom
U$49  [ADAFRUIT_3.5MM]  29.72,9.14 0 top
X1  26.42,11.18 270 top
X2  10.8,19.3 0 top
X3  4.45,11.43 270 top
X4  31.75,15.75 90 top

### Tracks (layer width: path | path; a pad name or v marks a point on that pad's centre or on a via)
3.3V  (via drill 0.5)
  Top 0.254: 23.62,13.34 X1.1 23.18,13.34 | D4.C 28.22,18.29 | C8.1 11.87,1.71 MS1.3 | v8.89,5.59 9.02,5.46 9.02,3.68 8.89,3.56 MS1.2 | 26.8,15.94 25.4,14.54 25.4,13.34 | U2.5 15.88,14.51 v15.88,14.86
  Top 0.305: MS1.3 MS1.2 | 23.18,13.34 19.94,13.34 19.56,13.08 18.41,13.08 18.16,13.34 17.05,13.34 U2.5 | U1.11 36.41,16.3 34.73,17.97 34.8,18.04 C3.1 34.8,19.56 34.67,19.69 28.83,19.69 28.25,19.1 D4.C | X1.1 25.4,13.34 | 26.99,18.29 26.99,18.8 26.48,19.81 23.2,19.81 R7.2 | 28.22,18.29 26.99,18.29 | 26.8,15.94 26.99,16.13 26.99,18.29
  Bottom 0.305: 16.48,9.75 18.73,12 18.73,12.83 17.97,13.59 17.02,13.59 15.88,14.73 v15.88,14.86
  Bottom 0.406: v8.89,5.59 8.89,5.33 9.84,4.38 11.87,4.38 15.5,8.01 15.5,8.77 16.48,9.75
A0/0.02  (via drill 0.5)
  Top 0.254: v30.61,13.34 30.86,13.59 32.89,13.59 33.21,13.91 U1.15
  Bottom 0.254: v30.61,13.34 30.51,13.24 28.22,13.24 27.05,12.07 25.65,12.07 23.94,10.35 23.94,9.34 18.54,3.94 18.54,2.67 17.78,1.91 17.14,1.91 MS1.5
A1/0.03  (via drill 0.5)
  Top 0.254: v31.62,12.7 32,13.08 33.08,13.08 33.21,13.21 U1.16
  Bottom 0.254: v31.62,12.7 31.37,12.45 28.19,12.45 27.18,11.56 25.91,11.56 24.45,10.1 24.45,9.14 19.05,3.75 MS1.6
A2/0.04  (via drill 0.5)
  Top 0.254: v31.31,11.56 31.69,11.56 32.64,12.51 U1.17
  Bottom 0.254: MS1.7 21.59,5.59 24.95,8.95 24.95,9.84 26.16,11.05 27.56,11.05 28.07,11.56 v31.31,11.56
A3/0.05  (via drill 0.5)
  Top 0.254: v32.26,10.92 32.32,10.92 32.32,11.11 33.02,11.81 U1.18
  Bottom 0.254: MS1.8 24.13,1.78 22.61,3.3 22.61,5.91 25.53,8.83 25.53,9.65 26.29,10.41 27.69,10.41 27.94,10.67 31.94,10.67 32.2,10.92 v32.26,10.92
A4/0.28  (via drill 0.5)
  Top 0.254: v40.64,12.19 41.53,13.08 41.53,14.22 40.61,15.14 U1.5
  Bottom 0.203: 28.45,3.05 40.51,3.05
  Bottom 0.254: MS1.9 28.45,3.05 | v40.64,12.19 40.39,11.94 40.39,5.46 41.02,4.83 41.02,3.56 40.51,3.05
A5/0.29  (via drill 0.5)
  Top 0.254: v40.64,13.84 39.91,14.57 U1.6
  Bottom 0.254: MS1.10 30.48,2.54 40.77,2.54 41.53,3.3 41.53,5.08 40.89,5.72 40.89,11.3 41.53,11.94 41.53,13.08 40.77,13.84 v40.64,13.84
A6/P0.30  (via drill 0.5)
  Top 0.254: U1.7 39.21,13.43 v38.86,13.08
  Bottom 0.254: v38.86,13.08 39.24,13.46 39.24,17.4 36.83,19.81 MS1.20
A7/P0.31  (via drill 0.5)
  Top 0.254: U1.8 38.51,14.63 v38.35,14.48 | MS1.21 34.29,21.08 33.53,20.32 22.61,20.32 21.17,18.76 C12.1 20.47,19.43 18.29,19.43 17.84,18.99 17.84,18.94 R4.2 16.42,17.52 R6.1
  Bottom 0.254: v38.35,14.48 38.35,17.4 34.29,21.46 MS1.21
DFU  (via drill 0.5)
  Top 0.203: SW2.B 42.52,3.14 SW2.B'
  Top 0.254: U1.34 42.01,8.29 v42.42,8.7 | 42.52,3.14 44.39,1.27 MS1.16
  Bottom 0.254: v42.42,8.7 42.16,8.45 42.16,3.62 44.45,1.33 MS1.16
DTR
  Top 0.254: U4.23 21.2,6.69 C11.2
EN  (via drill 0.5)
  Top 0.254: v19.49,16.96 19.08,16.54 U2.3 | 19.53,16.99 v19.49,16.96 | R5.1 19.58,16.87 v19.49,16.96
  Bottom 0.254: MS1.27 19.05,17.4 v19.49,16.96
FRST  (via drill 0.5)
  Top 0.254: U1.38 44.83,7.19 v44.83,5.59
  Bottom 0.254: TP2.P$1 44.83,4.12 v44.83,5.59
GND  (via drill 0.5)
  Top 0.203: U1.39 45.87,7.06 SW2.A
  Top 0.254: D2.C 49.31,17.56 48.26,16.51 45.71,16.51 U1.1 | 19.43,8.83 19.29,8.69 U4.2 19.29,6.15 v18.99,5.84 | C8.2 11.53,5.46 | X1.3 22.19,12.07 R8.2 | SW1.B 9.67,8.53 9.14,8 9.08,8 8.7,7.62 | D1.C 0.64,16.8 0.64,16 | X1.9 25.65,8.26 v26.29,7.62 | R6.2 19.02,18.22 C12.2
  Top 0.305: C3.2 32.9,18.03 v33.85,17.08
  Bottom 0.254: 16.13,3.05 17.14,3.05
  other vias: 10.1,5.72 7.18,15.24 17.65,14.61 44.51,15.43 45.28,14.16 41.4,19.56 43.05,4.64 42.55,14.8 28.57,16.76 24.38,15.05 10.16,2.22 28.57,5.59 33.59,6.29 25.27,2.54 21.46,11.18 19.43,11.43 44.58,13.14 43.81,14.29 42.99,13.08 2.48,11.43 9.84,18.8 13.02,14.61 26.54,14.48
  pour Bottom (isolate 0.254): 45.72,0 0,0 0,22.86 45.72,22.86
  pour Top (isolate 0.254): 45.82,0 0,0 0,22.86 45.82,22.86
LED1  (via drill 0.5)
  Top 0.254: U1.31 39.91,8.6 v39.37,9.14 | R1.2 5.78,19.33 v5.78,20.64
  Bottom 0.254: v39.37,9.14 37.97,7.75 36.45,7.75 35.31,8.89 35.31,9.53 34.54,10.29 34.54,11.43 34.04,11.94 33.15,11.94 32.51,12.57 32.51,13.34 31.62,14.22 29.21,14.22 28.96,13.97 28.19,13.97 27.69,14.48 27.69,16.89 26.54,18.03 22.99,18.03 20.83,15.88 19.43,15.88 17.53,17.78 11.94,17.78 10.41,16.26 7.62,16.26 5.78,18.1 v5.78,20.64
LED2  (via drill 0.5)
  Top 0.254: U1.33 41.31,9.18 v41.78,9.65 | v43.69,16.76 43.98,17.06 R2.2
  Bottom 0.254: v43.69,16.76 43.69,16.26 43.56,16.13 42.55,16.13 41.53,15.11 41.53,13.84 42.04,13.34 42.04,11.68 41.4,11.05 41.4,10.03 v41.78,9.65
MISO
  Top 0.203: 37.81,5.68 36.7,4.57 34.67,4.57
  Top 0.254: U1.28 37.81,5.68 | 34.67,4.57 34.16,4.06 34.16,3.05 34.67,2.54 34.92,2.54 36.2,1.27 MS1.13
MOSI
  Top 0.254: U1.27 37.11,5.74 36.45,5.08 34.42,5.08 33.66,4.32 33.66,1.27 MS1.12
N$1
  Top 0.254: U1.13 33.2,15.31 31.75,16.76 X4.P$1 31.75,17.89 C1.1
N$2
  Top 0.254: U1.14 31.81,14.61 X4.P$2 30.42,14.55 C2.1
N$3
  Top 0.254: U1.10 37.11,17.57 L2.2
N$4
  Top 0.254: CHG.C 4.95,4.1 R3.1
N$5
  Top 0.254: D1.A 3.5,17.57 R1.1
N$7
  Top 0.254: R2.1 47.21,18.03 D2.A
N$8
  Top 0.254: U1.9 37.81,17.81 L2.1 39.66,18.29 C4.1
N$9  (via drill 0.5)
  Top 0.254: U3.1 17.7,12.37 v17.78,12.45 | 6.84,4.08 R3.2 6.79,4.15 v6.79,6.22
  Bottom 0.254: v6.79,6.22 6.35,6.67 6.35,11.68 15.24,11.68 16,12.45 v17.78,12.45
N$10
  Top 0.254: U3.5 R8.1
N$11
  Top 0.254: U4.21 21.12,5.69 21.72,6.29 22.71,6.29 R9.1
N$13  (via drill 0.5)
  Top 0.254: C11.1 21.57,8.76 v20.57,8.76
  Bottom 0.254: SJ2.2 19.69,7.49 20.45,8.26 20.45,8.64 v20.57,8.76
N$14
  Top 0.254: U4.16 18.79,3.17 18.54,2.92 15.68,2.92 14.61,2.92 C7.1
P0.07  (via drill 0.5)
  Top 0.254: U1.20 36.2,10.41 36.45,10.67 v36.83,10.67
  Bottom 0.254: MS1.23 30.99,19.81 34.29,19.81 36.96,17.15 36.96,13.97 37.47,13.46 37.47,11.56 36.83,10.92 v36.83,10.67
P0.09/NFC1
  Top 0.203: 30.61,5.65 31.56,6.6 32.13,6.6 32.64,7.11 32.64,8.13 32.96,8.45 32.96,8.83 33.15,9.02 U1.22
  Top 0.254: 30.61,5.65 30.54,5.59 JP2.1 30.1,5.52 C13.1
P0.10/NFC2
  Top 0.203: 33.08,6.92 33.08,7.94 33.46,8.31 U1.23
  Top 0.254: 33.08,6.92 32.07,5.91 JP1.1 32,4.64 C9.1
P0.11  (via drill 0.5)
  Top 0.254: U1.25 35.71,8.53 36.58,9.4 v37.08,9.4
  Bottom 0.254: MS1.22 33.02,20.32 34.54,20.32 37.47,17.4 37.47,14.22 37.97,13.72 37.97,10.54 37.08,9.65 v37.08,9.4
P0.15  (via drill 0.5)
  Top 0.254: v36.58,12.32 36.58,12.19 37.97,10.8 37.97,8.57 38.48,8.07 38.48,7.24 U1.29
  Bottom 0.254: MS1.24 28.96,19.3 34.04,19.3 36.45,16.89 36.45,13.72 36.83,13.34 36.83,12.57 v36.58,12.32
P0.16  (via drill 0.5)
  Top 0.254: v35.81,13.21 36.96,13.21 37.47,12.7 37.47,12.19 38.48,11.18 38.48,8.83 39.24,8.07 39.24,7.24 U1.30
  Bottom 0.254: v35.81,13.21 35.81,16.38 33.53,18.67 28.83,18.67 27.3,20.19 25.53,20.19 MS1.25
P0.27
  Top 0.203: 40.51,20.38 40.51,17.59 40.58,17.53 41.27,17.53 41.31,17.49 U1.4
  Top 0.254: 40.51,20.38 39.37,21.53 MS1.19
RESET  (via drill 0.5)
  Top 0.254: MS1.1 8.22,3.14 SW1.A' 8.22,4.74 7.62,5.33 7.62,7.93 SW1.A | R7.1 D4.A 26.04,17.93 v26.04,16.57 | U1.35 42.71,6.33 42.42,6.03 40.96,6.03 40.39,5.46 39.31,5.46 38.92,5.08 v38.92,4.83 | v22.23,10.16 22.61,9.78 22.61,7.75 22.86,7.49 23.62,7.49 24.64,6.48 v25.53,6.48 26.54,6.48 27.3,7.24 27.3,8.26 X1.10
  Bottom 0.254: v38.92,4.83 38.67,4.57 38.67,4.13 38.1,3.56 37.59,3.56 35.94,5.21 34.29,5.21 33.66,4.57 27.11,4.57 25.53,6.16 v25.53,6.48 | MS1.1 8.19,3.11 14.29,3.11 14.86,2.54 17.53,2.54 17.91,2.92 17.91,9.02 18.03,9.14 18.92,9.14 SJ2.1 19.05,9.14 19.56,9.65 21.72,9.65 v22.23,10.16 22.35,10.67 25.4,13.72 25.4,15.94 v26.04,16.57
RXD  (via drill 0.5)
  Top 0.254: MS1.14 38.1,2.54 36.32,2.54 v35.05,3.81 | U1.21 33.02,9.72 32.51,9.21 32.51,8.64 32.2,8.32 32.2,7.3 32,7.11 31.43,7.11 30.99,6.67 28.32,6.67 25.97,4.32 v25.02,4.32 23.53,4.32 R9.2
  Bottom 0.254: v25.02,4.32 25.15,4.32 25.91,3.56 34.8,3.56 v35.05,3.81
SCK
  Top 0.254: U1.26 36.41,5.8 36.2,5.59 34.16,5.59 33.02,4.45 33.02,1.27 MS1.11
SCL
  Top 0.254: U1.3 42.01,17.37 42.42,17.78 42.42,20.7 41.91,21.21 MS1.18
SDA
  Top 0.254: U1.2 42.71,17.06 42.93,17.27 42.93,19.81 44.45,21.34 MS1.17
SWCLK  (via drill 0.5)
  Top 0.254: X1.4 30.48,12.45 30.48,11.3 30.42,11.18 30.73,10.86 30.73,10.41 31.18,9.97 v31.18,9.78 | U1.36 43.41,6.01 42.93,5.52 41.15,5.52 40.07,4.45 v40.07,4.06
  Bottom 0.254: v40.07,4.06 40.07,4.89 39.24,5.72 37.78,5.72 34.73,8.76 TP4.P$1 33.34,9.27 v31.18,9.78
SWDIO  (via drill 0.5)
  Top 0.203: 44.11,7.53 44.39,8.51
  Top 0.254: U1.37 44.11,7.53 | 44.39,8.51 44.39,9.78 43.69,10.48 v39.37,10.48 | X1.2 28.57,13.34 v28.57,14.8
  Bottom 0.254: v28.57,14.8 32.07,14.8 33.78,13.08 33.78,13.21 TP3.P$1 35.18,12.07 35.18,10.54 35.94,9.78 35.94,9.14 36.58,8.51 37.85,8.51 38.23,8.89 38.23,9.91 38.8,10.48 v39.37,10.48
  Bottom 0.305: 33.78,13.08 33.81,13.05
SWO  (via drill 0.5)
  Top 0.254: X1.6 29.66,11.05 30.23,10.48 30.23,9.46 30.61,9.08 v30.61,8.76 | U1.32 40.61,6.38 40.2,5.97 38.8,5.97 37.85,5.02 v37.85,4.45
  Bottom 0.254: v37.85,4.45 35.05,7.24 31.62,7.24 v30.61,8.76
TXD  (via drill 0.5)
  Top 0.203: 21.97,5.72 24.38,5.72
  Top 0.254: U4.20 21.39,5.19 21.91,5.72 21.97,5.72 | 24.77,5.59 v24.51,5.59 | v36.2,3.81 36.96,3.05 38.48,3.05 38.99,2.54 40.13,2.54 41.4,1.27 MS1.15 | v24.51,5.59 26.42,5.59 28,7.18 30.8,7.18 31.24,7.62 31.69,7.62 31.69,8.51 32,8.83 32,9.53 33.08,10.6 33.08,10.92 33.27,11.11 U1.19 | 24.38,5.72 v24.51,5.59
  Bottom 0.254: v36.2,3.81 35.31,4.7 34.54,4.7 33.91,4.06 26.8,4.06 25.27,5.59 v24.51,5.59
USBD+
  Top 0.254: X3.D+ 5.92,11.43 6.35,11 6.35,10.26 7.26,9.35 10.97,9.35 11.3,9.02 11.3,8.51 11.56,8.26 12.83,8.26 13.34,7.75 14.86,7.75 15.18,8.07 15.18,8.95 15.56,9.34 18.54,9.34 18.79,9.09 U4.3
USBD-  (via drill 0.5)
  Top 0.254: X3.D- 5.98,12.08 6.86,11.2 6.86,10.8 7.39,10.26 v8.2,10.26 | U4.4 18.29,8.44 17.91,8.83 15.88,8.83 15.68,8.64 15.68,7.81 15.11,7.24 13.08,7.24 12.57,7.75 9.98,7.75 9.51,7.28 v9.51,7.21
  Bottom 0.254: v8.2,10.26 9.51,8.95 v9.51,7.21
VBAT
  Top 0.406: U3.3 15.85,10.47 C5.1 13.03,11.86 13.02,11.87 | Q3.3 13.02,11.87 | 13.02,11.87 13.02,12.89 11.8,14.11 X2.2 12.81,15.6 R4.1 15.89,20.97 MS1.28
VBUS  (via drill 0.5)
  Top 0.254: R12.2 8.34,12.35 D5.A | CHG.A 1.36,6 0.89,6.48 0.89,9.4 1.02,9.53 1.02,12.83 1.27,13.08 3.68,13.08 4.06,12.7 5.19,12.7 X3.VBUS | v10.66,6.92 10.98,7.24 12.32,7.24 12.86,6.69 U4.8 U4.7 | 17.78,10.29 17.34,9.84 15.24,9.84 14.67,9.27 14.67,8.26 13.54,8.26 12.72,9.08 12.15,9.08 Q3.1 | MS1.26 21.59,20.96 20.7,20.07 v17.53,20.07
  Top 0.406: X3.VBUS 6.19,12.73 6.99,11.94 D5.A 8.64,11.94 v10.29,10.29 10.94,10.29 Q3.1 | 17.78,10.29 17.96,10.47 U3.4 20.31,10.47 v20.45,10.6
  Top 0.61: R12.2 8.38,13.76 v8.38,17.78
  Bottom 0.406: v10.66,6.92 10.66,9.59 10.67,9.59 10.29,9.97 v10.29,10.29
  Bottom 0.61: v8.38,17.78 8.38,19.18 9.27,20.07 v17.53,20.07
VCCIO  (via drill 0.5)
  Top 0.254: U4.5 U4.6 16.57,7.94 v16.48,8 | v16.48,3.84 15.5,3.84 C10.1
  Bottom 0.254: v16.48,8 v16.48,3.84
VIN  (via drill 0.5)
  Top 0.254: R5.2 23.65,17.12 v23.81,16.96 | U2.1 19.94,13.91 20.07,14.04
  Top 0.305: R5.2 20.82,15.26 C6.1 20.82,14.79 20.07,14.04
  Top 0.406: v10.16,12.57 10.99,12.57 D5.C 11.63,10.85 12.32,10.16 13.46,10.16 13.97,9.66 Q3.2
  Bottom 0.406: v10.16,12.57 13.34,12.57 14.1,13.34 14.1,15.37 14.73,16 17.65,16 19.05,14.61 21.78,14.61 23.88,16.7 v23.81,16.96

### Text on the board
tPlace: BAT | EN | USB | 16 | 15 | 7 | 11 | 31 | * | 30 | 27 | SCL | SDA | 17 | RESET | Feather | nRF52 | NFC | CHG | MOSI | MISO | 3v | A2 | RXD | TXD | DFU | Rst | 3v | G | A0 | A1 | A3 | A4 | A5 | SCK
bPlace: 3.7/4.2V / LiPoly Batt / µUSB charge | 7 | EN | USB | 16 | 15 | 11 | 31 | 30 | 27 | SCL | SDA | VBAT | ^ VBATADC | nRF52832 Bluefruit Feather | SWDIO | SWCLK | NFC2 | NFC1 | AUTORST | Reset | MOSI | MISO | F.RST | 3.3v | 3.3v | GND | A0 | A1 | A2 | A3 | A4 | A5 | SCK | RXD | TXD | DFU